# Altium schematic sheet 02-PowerSupply.SchDoc
size A4; DocumentNumber: 2; SheetNumber: 2; SheetTotal: 26
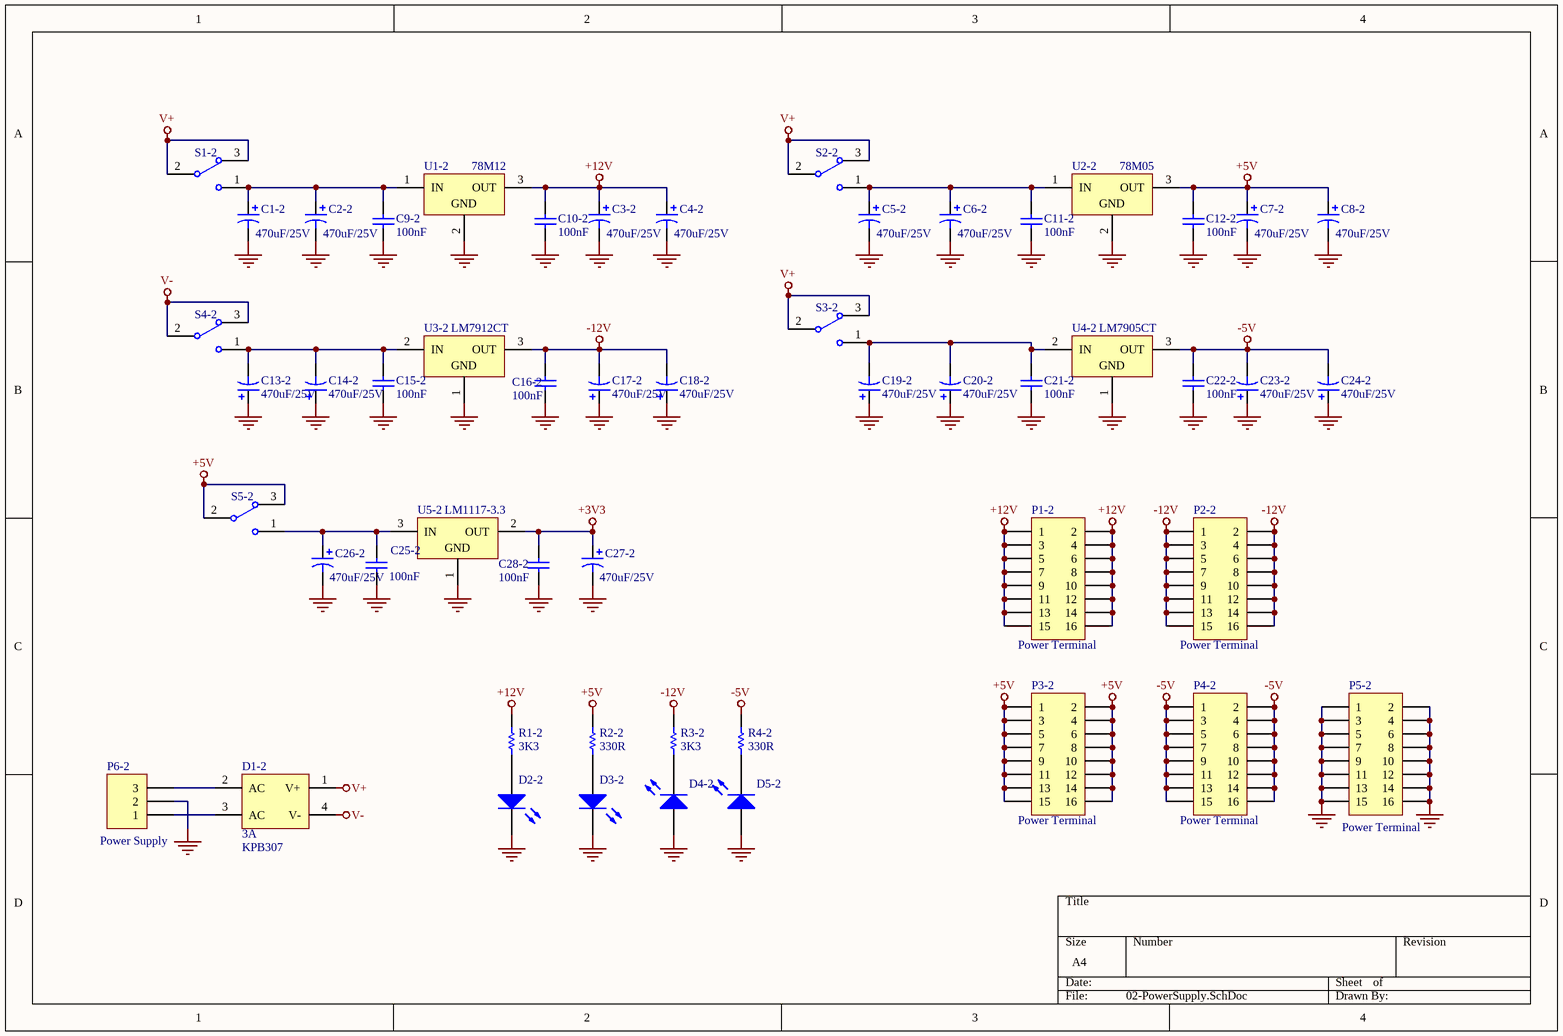
[diagram p0: 02-PowerSupply.SchDoc]

## Parts
C1-2  470uF/25V  [C-ALU-10x10mm]
C2-2  470uF/25V  [C-ALU-10x10mm]
C3-2  470uF/25V  [C-ALU-10x10mm]
C4-2  470uF/25V  [C-ALU-10x10mm]
C5-2  470uF/25V  [C-ALU-10x10mm]
C6-2  470uF/25V  [C-ALU-10x10mm]
C7-2  470uF/25V  [C-ALU-10x10mm]
C8-2  470uF/25V  [C-ALU-10x10mm]
C9-2  value 100nF  [c-0805]  (hidden comment: 104)
C10-2  value 100nF  [c-0805]  (hidden comment: 104)
C11-2  value 100nF  [c-0805]  (hidden comment: 104)
C12-2  value 100nF  [c-0805]  (hidden comment: 104)
C13-2  470uF/25V  [C-ALU-10x10mm]
C14-2  470uF/25V  [C-ALU-10x10mm]
C15-2  value 100nF  [c-0805]  (hidden comment: 104)
C16-2  value 100nF  [c-0805]  (hidden comment: 104)
C17-2  470uF/25V  [C-ALU-10x10mm]
C18-2  470uF/25V  [C-ALU-10x10mm]
C19-2  470uF/25V  [C-ALU-10x10mm]
C20-2  470uF/25V  [C-ALU-10x10mm]
C21-2  value 100nF  [c-0805]  (hidden comment: 104)
C22-2  value 100nF  [c-0805]  (hidden comment: 104)
C23-2  470uF/25V  [C-ALU-10x10mm]
C24-2  470uF/25V  [C-ALU-10x10mm]
C25-2  value 100nF  [c-0805]  (hidden comment: 104)
C26-2  470uF/25V  [C-ALU-10x10mm]
C27-2  470uF/25V  [C-ALU-10x10mm]
C28-2  value 100nF  [c-0805]  (hidden comment: 104)
D1-2  KPB307  value 3A  [D-DB-3A]
D2-2  LED  [LED-0805]  (value not drawn)
D3-2  LED  [LED-0805]  (value not drawn)
D4-2  LED  [LED-0805]  (value not drawn)
D5-2  LED  [LED-0805]  (value not drawn)
P1-2  value Power Terminal  [JP2.54-F-2x08A]  (hidden comment: Header 8X2)
P2-2  value Power Terminal  [JP2.54-F-2x08A]  (hidden comment: Header 8X2)
P3-2  value Power Terminal  [JP2.54-F-2x08A]  (hidden comment: Header 8X2)
P4-2  value Power Terminal  [JP2.54-F-2x08A]  (hidden comment: Header 8X2)
P5-2  value Power Terminal  [JP2.54-F-2x08A]  (hidden comment: Header 8X2)
P6-2  value Power Supply  [TER-KF128-3]  (hidden comment: H3)
R1-2  value 3K3  [R-0805]  (hidden comment: 332)
R2-2  value 330R  [R-0805]  (hidden comment: 331)
R3-2  value 3K3  [R-0805]  (hidden comment: 332)
R4-2  value 330R  [R-0805]  (hidden comment: 331)
S1-2  SW-SPDT  [SW-SLIDE-2P-2W]  (value not drawn)
S2-2  SW-SPDT  [SW-SLIDE-2P-2W]  (value not drawn)
S3-2  SW-SPDT  [SW-SLIDE-2P-2W]  (value not drawn)
S4-2  SW-SPDT  [SW-SLIDE-2P-2W]  (value not drawn)
S5-2  SW-SPDT  [SW-SLIDE-2P-2W]  (value not drawn)
U1-2  78M12  [TO-252-3]
U2-2  78M05  [TO-252-3]
U3-2  LM7912CT  [TO-263-3]
U4-2  LM7905CT  [TO-263-3]
U5-2  LM1117-3.3  [SOT-223-3]

## Nets
+3V3: C27-2.1 C28-2.2 U5-2.2(OUT)
+5V: C7-2.1 C8-2.1 C12-2.2 P3-2.1 P3-2.2 P3-2.3 P3-2.4 P3-2.5 P3-2.6 P3-2.7 P3-2.8 P3-2.9 P3-2.10 P3-2.11 P3-2.12 P3-2.13 P3-2.14 P3-2.15 P3-2.16 R2-2.1 S5-2.2 S5-2.3 U2-2.3(OUT)
+12V: C3-2.1 C4-2.1 C10-2.2 P1-2.1 P1-2.2 P1-2.3 P1-2.4 P1-2.5 P1-2.6 P1-2.7 P1-2.8 P1-2.9 P1-2.10 P1-2.11 P1-2.12 P1-2.13 P1-2.14 P1-2.15 P1-2.16 R1-2.1 U1-2.3(OUT)
-5V: C22-2.2 C23-2.2 C24-2.2 P4-2.1 P4-2.2 P4-2.3 P4-2.4 P4-2.5 P4-2.6 P4-2.7 P4-2.8 P4-2.9 P4-2.10 P4-2.11 P4-2.12 P4-2.13 P4-2.14 P4-2.15 P4-2.16 R4-2.1 U4-2.3(OUT)
-12V: C16-2.2 C17-2.2 C18-2.2 P2-2.1 P2-2.2 P2-2.3 P2-2.4 P2-2.5 P2-2.6 P2-2.7 P2-2.8 P2-2.9 P2-2.10 P2-2.11 P2-2.12 P2-2.13 P2-2.14 P2-2.15 P2-2.16 R3-2.1 U3-2.3(OUT)
GND: C1-2.2 C2-2.2 C3-2.2 C4-2.2 C5-2.2 C6-2.2 C7-2.2 C8-2.2 C9-2.1 C10-2.1 C11-2.1 C12-2.1 C13-2.1 C14-2.1 C15-2.1 C16-2.1 C17-2.1 C18-2.1 C19-2.1 C20-2.1 C21-2.1 C22-2.1 C23-2.1 C24-2.1 C25-2.1 C26-2.2 C27-2.2 C28-2.1 D2-2.1(K) D3-2.1(K) D4-2.2(A) D5-2.2(A) P5-2.1 P5-2.2 P5-2.3 P5-2.4 P5-2.5 P5-2.6 P5-2.7 P5-2.8 P5-2.9 P5-2.10 P5-2.11 P5-2.12 P5-2.13 P5-2.14 P5-2.15 P5-2.16 P6-2.2 U1-2.2(GND) U2-2.2(GND) U3-2.1(GND) U4-2.1(GND) U5-2.1(GND)
V+: D1-2.1(V+) S1-2.2 S1-2.3 S2-2.2 S2-2.3 S3-2.2 S3-2.3
V-: D1-2.4(V-) S4-2.2 S4-2.3
NetC1-2_1: C1-2.1 C2-2.1 C9-2.2 S1-2.1 U1-2.1(IN)
NetC5-2_1: C5-2.1 C6-2.1 C11-2.2 S2-2.1 U2-2.1(IN)
NetC13-2_2: C13-2.2 C14-2.2 C15-2.2 S4-2.1 U3-2.2(IN)
NetC19-2_2: C19-2.2 C20-2.2 C21-2.2 S3-2.1 U4-2.2(IN)
NetC25-2_2: C25-2.2 C26-2.1 S5-2.1 U5-2.3(IN)
NetD1-2_2: D1-2.2(AC) P6-2.3
NetD1-2_3: D1-2.3(AC) P6-2.1
NetD2-2_2: D2-2.2(A) R1-2.2
NetD3-2_2: D3-2.2(A) R2-2.2
NetD4-2_1: D4-2.1(K) R3-2.2
NetD5-2_1: D5-2.1(K) R4-2.2

## Library data of the parts
C1-2 C2-2 C3-2 C4-2 C5-2 C6-2 C7-2 C8-2 C13-2 C14-2 C17-2 C18-2 C19-2 C20-2 C23-2 C24-2 C26-2 C27-2 = Cap Pol1: Polarized Capacitor (Radial)
C9-2 C10-2 C11-2 C12-2 C15-2 C16-2 C21-2 C22-2 C25-2 C28-2 = Cap: Capacitor; Manufacturer: Generic Components; Class: Passive; Published: 08/06/2000; Publisher: Altium Hobart Technology Centre; SubClass: Capacitor
D1-2 = Bridge2: Diode Bridge; Published: 24-Mar-1999; LatestRevisionDate: 17-Jul-2002; LatestRevisionNote: Re-released for DXP Platform.; PackageReference: D-46_6A
D2-2 D3-2 D4-2 D5-2 = LED0: Typical INFRARED GaAs LED; Published: 8-Jun-2000; LatestRevisionDate: 08-Jul-2005; LatestRevisionNote: Mech Layer 1 removed.; PackageReference: LED-0; Publisher: Altium Limited; Value: LED
P1-2 P2-2 P3-2 P4-2 P5-2 = Header 8X2: Header, 8-Pin, Dual row; LatestRevisionDate: 17-Jul-2002; LatestRevisionNote: Re-released for DXP Platform.
P6-2 = Header 3: Header, 3-Pin; LatestRevisionDate: 17-Jul-2002; LatestRevisionNote: Re-released for DXP Platform.
R1-2 R2-2 R3-2 R4-2 = Res1: Resistor; Published: 8-Jun-2000; LatestRevisionDate: 17-Jul-2002; LatestRevisionNote: Re-released for DXP Platform.; PackageReference: AXIAL-0.3; Publisher: Altium Limited
S1-2 S2-2 S3-2 S4-2 S5-2 = SW-SPDT: SPDT Subminiature Toggle Switch, Right Angle Mounting, Vertical Actuation; Link: http://banlinhkien.vn/goods-5937-cong-tac-gat-6-chan-mss22d18-smd.html
U1-2 U2-2 = LM78M05CT: 3-Terminal Positive Voltage Regulators, 3-pin TO-220; Manufacturer: National Semiconductor; PackageTopMarking: NSUZXYTTE#*LM341T-5.0*LM78M05CT; PowerWise: N; CompType: LDO IC; Published: 4-Dec-2008; DatasheetVersion: Aug-2005; PackageVersion: revL, Jan-1992; PackageReference: T03B; Publisher: Altium Limited; PackageDescription: TO-220, Molded, 3 Lead, Straight; Supplier 1: Farnell; PartNumber: LM78M05CT; RoHS: N; PinCount: 3; ComponentLink1Description: LM78M05 Datasheet; ComponentLink1URL: http://www.national.com/ds/LM/LM78M05.pdf; ComponentLink2Description: LM78M05 Web Page; ComponentLink2URL: http://www.national.com/pf/LM/LM78M05.html; ComponentLink3Description: T03B Package Page; ComponentLink3URL: http://www.national.com/packaging/folders/t03b.html
  U1-2: Value: 78M12
  U2-2: Value: 78M05
U3-2 U4-2 = LM79M12CT: 3-Terminal Negative Regulators, 3-pin TO-220; Manufacturer: National Semiconductor; PackageTopMarking: NSUZXYTTE#*LM79M*12CT; PowerWise: N; CompType: LDO IC; Published: 4-Dec-2008; DatasheetVersion: Sep-2001; PackageVersion: revL, Jan-1992; PackageReference: T03B; Publisher: Altium Limited; PackageDescription: TO-220, Molded, 3 Lead, Straight; Supplier 1: Farnell; PartNumber: LM79M12CT; RoHS: N; PinCount: 3; ComponentLink1Description: LM79M12 Datasheet; ComponentLink1URL: http://www.national.com/ds/LM/LM79M12.pdf; ComponentLink2Description: LM79M12 Web Page; ComponentLink2URL: http://www.national.com/pf/LM/LM79M12.html; ComponentLink3Description: T03B Package Page; ComponentLink3URL: http://www.national.com/packaging/folders/t03b.html
  U3-2: Value: LM7912CT
  U4-2: Value: LM7905CT
U5-2 = LM1117IDTX-3.3: 800mA Low-Dropout Linear Regulator, 3-pin TO-252; Manufacturer: National Semiconductor; PackageTopMarking: NSUZXYTT*LM1117*IDT-3.3; PowerWise: N; CompType: LDO IC; Published: 1-Mar-2010; DatasheetVersion: Apr-2006; PackageVersion: revD, Feb-2009; PackageReference: TD03B; Publisher: Altium Limited; PackageDescription: TO252, Molded, Jedec, 6.8 x 6.10 x 2.30mm Body, 3 Lead, 2.28mm Pitch, Surface Mount; PartNumber: LM1117IDTX-3.3; Value: LM1117-3.3; PinCount: 3; Code_JEDEC: TO-252-AA; ComponentLink1Description: LM1117 Datasheet; ComponentLink1URL: http://www.national.com/ds/LM/LM1117.pdf; ComponentLink2Description: LM1117 Web Page; ComponentLink2URL: http://www.national.com/pf/LM/LM1117.html; ComponentLink3Description: TD03B Package Page; ComponentLink3URL: http://www.national.com/packaging/folders/td03b.html